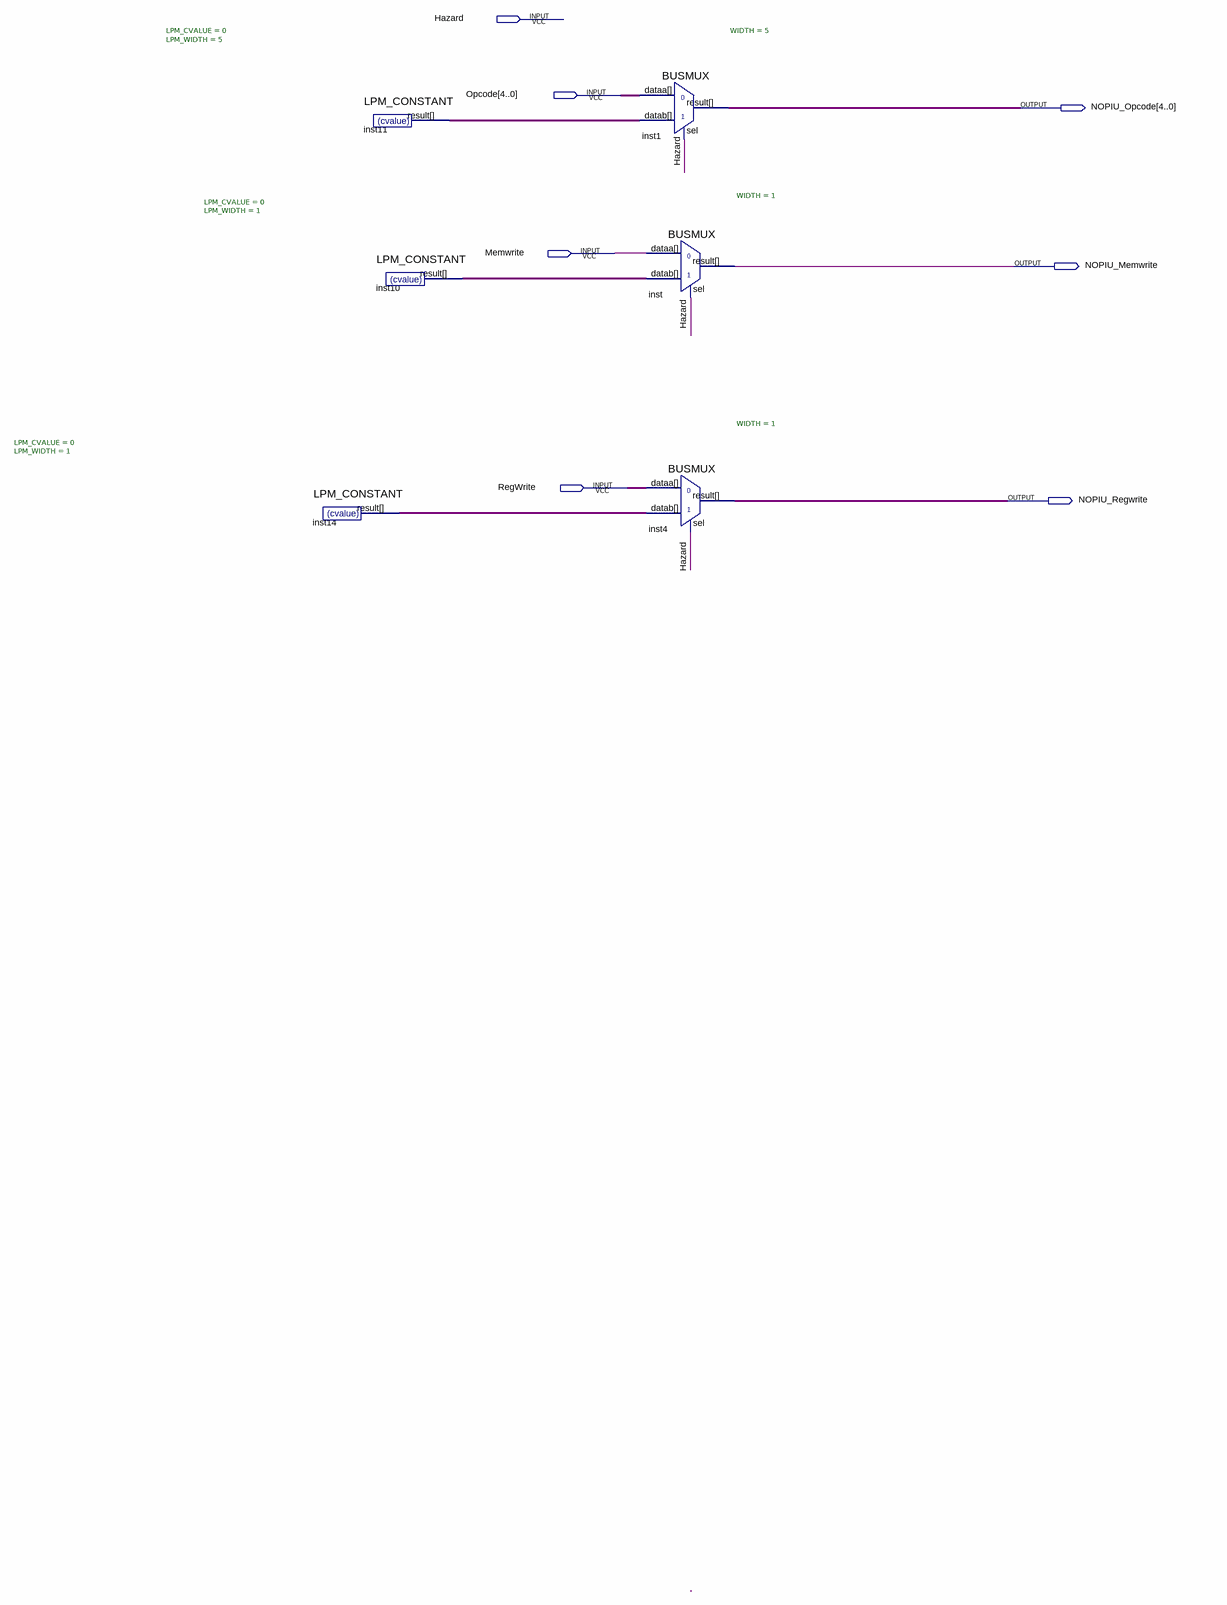
[diagram p0: schematic sheet]
// Quartus schematic NOPIU.bdf as structural Verilog: 6 symbols, 7 pins
module NOPIU (
  input  Hazard,
  input  [4:0] Opcode,
  input  Memwrite,
  input  RegWrite,
  output [4:0] NOPIU_Opcode,
  output NOPIU_Memwrite,
  output NOPIU_Regwrite
);

  wire inst10_result, inst14_result;
  wire [4:0] inst11_result;

  LPM_CONSTANT #(.LPM_CVALUE(0), .LPM_WIDTH(1)) inst14 (.result(inst14_result));
  LPM_CONSTANT #(.LPM_CVALUE(0), .LPM_WIDTH(5)) inst11 (.result(inst11_result));
  LPM_CONSTANT #(.LPM_CVALUE(0), .LPM_WIDTH(1)) inst10 (.result(inst10_result));
  BUSMUX #(.WIDTH(5)) inst1 (.datab(inst11_result), .sel(Hazard), .dataa(Opcode), .result(NOPIU_Opcode));
  BUSMUX #(.WIDTH(1)) inst (.datab(inst10_result), .sel(Hazard), .dataa(Memwrite), .result(NOPIU_Memwrite));
  BUSMUX #(.WIDTH(1)) inst4 (.datab(inst14_result), .sel(Hazard), .dataa(RegWrite), .result(NOPIU_Regwrite));
endmodule
